# EAGLE design LEDCyrWheel (EAGLE 7.5.0)
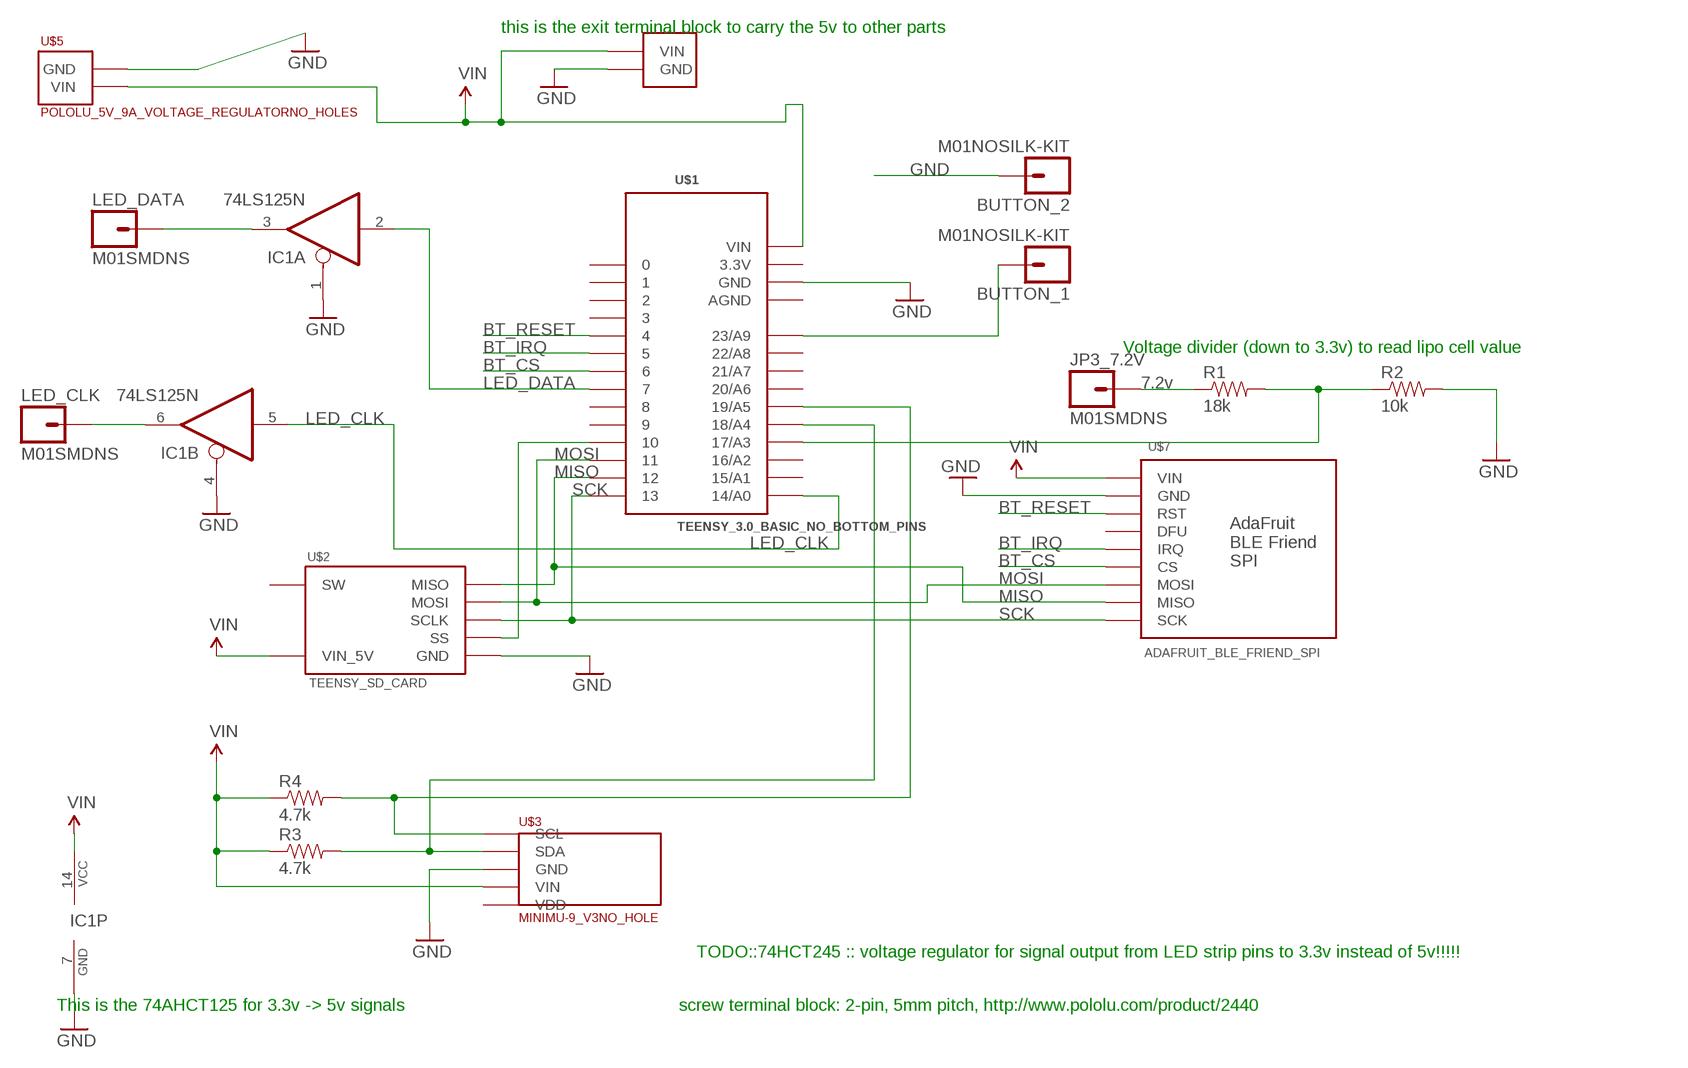
[diagram p0: schematic, sheet 1]

## Parts
BUTTON_1  M01NOSILK-KIT  [1X01NS-KIT]
BUTTON_2  M01NOSILK-KIT  [1X01NS-KIT]
IC1  74LS125N  [DIL14]
JP3_7.2V  M01SMDNS  [1X01NS]
LED_CLK  M01SMDNS  [1X01NS]
LED_DATA  M01SMDNS  [1X01NS]
R1  18k  RESISTORPTH-1/4W  [AXIAL-0.4]
R2  10k  RESISTORPTH-1/4W  [AXIAL-0.4]
R3  4.7k  RESISTORPTH-1/4W  [AXIAL-0.4]
R4  4.7k  RESISTORPTH-1/4W  [AXIAL-0.4]
U$1  TEENSY_3.0_BASIC_NO_BOTTOM_PINS  [TEENSY_3.0_BASIC_NO_BOTTOM_PINS]
U$2  TEENSY_SD_CARD  [TEENSY_SD_CARD]
U$3  MINIMU-9_V3NO_HOLE  [MINIMU-9_V3_NO_HOLE]
U$5  POLOLU_5V_9A_VOLTAGE_REGULATORNO_HOLES  [POLOLU_5V_9A_VOLTAGE_REGULATOR_NO_HOLES]
U$6  VIN_GND_HOLE  [VIN_HOLE]
U$7  ADAFRUIT_BLE_FRIEND_SPI  [ADAFRUIT_BLE_FRIEND_SPI]

## Nets
BT_CS: U$1.6 U$7.CS
BT_IRQ: U$1.5 U$7.IRQ
BT_RESET: U$1.4 U$7.RST
GND: BUTTON_2.1 IC1.1(A:OE) IC1.4(B:OE) IC1.7(P:GND) R2.P$2 U$1.GND U$2.GND U$3.GND U$5.GND U$5.GND2(GND) U$5.GND3(GND) U$6.GND U$7.GND
LED_CLK: IC1.5(B:I) U$1.14/A0
LED_DATA: IC1.2(A:I) U$1.7
MISO: U$1.12 U$2.MISO U$7.MISO
MOSI: U$1.11 U$2.MOSI U$7.MOSI
N$1: U$1.10 U$2.SS
N$2: IC1.6(B:O) LED_CLK.1
N$8: BUTTON_1.1 U$1.23/A9
N_PIN17: R1.P$2 R2.P$1 U$1.17/A3
N_PIN_2_LED_STRIP: IC1.3(A:O) LED_DATA.1
SCK: U$1.13 U$2.SCLK U$7.SCK
SCL: R4.P$2 U$1.19/A5 U$3.SCL
SDA: R3.P$2 U$1.18/A4 U$3.SDA
VIN: IC1.14(P:VCC) R3.P$1 R4.P$1 U$1.VIN U$2.VIN(VIN_5V) U$3.VIN U$5.VIN U$5.VIN2(VIN) U$5.VIN3(VIN) U$6.VIN U$7.VIN
VIN_7_2V: JP3_7.2V.1 R1.P$1
Unconnected: IC1.8(C:O) IC1.9(C:I) IC1.10(C:OE) IC1.11(D:O) IC1.12(D:I) IC1.13(D:OE) U$1.0 U$1.1 U$1.2 U$1.3 U$1.8 U$1.9 U$1.15/A1 U$1.16/A2 U$1.20/A6 U$1.21/A7 U$1.22/A8 U$2.SW U$3.VDD U$7.DFU

## Notes on the sheet
- this is the exit terminal block to carry the 5v to other parts
- Voltage divider (down to 3.3v) to read lipo cell value
- TODO::74HCT245 :: voltage regulator for signal output from LED strip pins to 3.3v instead of 5v!!!!!
- This is the 74AHCT125 for 3.3v -> 5v signals | screw terminal block: 2-pin, 5mm pitch, http://www.pololu.com/product/2440

## Power pins joined to a net without a drawn wire
3.3V: U$1.3.3V
AGND: U$1.AGND

## Library data of the parts
BUTTON_1 BUTTON_2 = SparkFun-Connectors:M01: Header 1 Standard 1-pin 0.1" header. Use with straight break away headers (SKU : PRT-00116), right angle break away headers (PRT-00553), swiss pins (PRT-00743), machine pins (PRT-00117), and female headers (PRT-00115).
IC1 = adafruit:74*125: Quad bus BUFFER, 3-state
JP3_7.2V = SparkFun:M01: Header 1 Standard 1-pin 0.1" header. Use with straight break away headers (SKU : PRT-00116), right angle break away headers (PRT-00553), swiss pins (PRT-00743), machine pins (PRT-00117), and female headers (PRT-00115).; VOLTAGE: 7.2v
LED_CLK LED_DATA = SparkFun:M01: Header 1 Standard 1-pin 0.1" header. Use with straight break away headers (SKU : PRT-00116), right angle break away headers (PRT-00553), swiss pins (PRT-00743), machine pins (PRT-00117), and female headers (PRT-00115).
R1-R4 = SparkFun:RESISTOR: Resistor Basic schematic elements and footprints for 0603, 1206, and PTH resistors.
U$1 = Teensy3.0:TEENSY_3.0_BASIC_NO_BOTTOM_PINS: Basic Teensy 3.0 with none of the 'inner' pins enabled. See '+4', 'AllAnalogPins", and 'AllPins' packages for additional pin holes, as needed.
U$2 = LEDCyrWheel:TEENSY_SD_CARD: TEENSY SD Card Aadapter
U$3 = LEDCyrWheel:MINIMU-9_V3: POLOLU's MinIMU-9 v3
U$5 = LEDCyrWheel:POLOLU_5V_9A_VOLTAGE_REGULATOR
U$6 = LEDCyrWheel:VIN_GND_HOLE
U$7 = LEDCyrWheel:ADAFRUIT_BLE_FRIEND_SPI

## Board
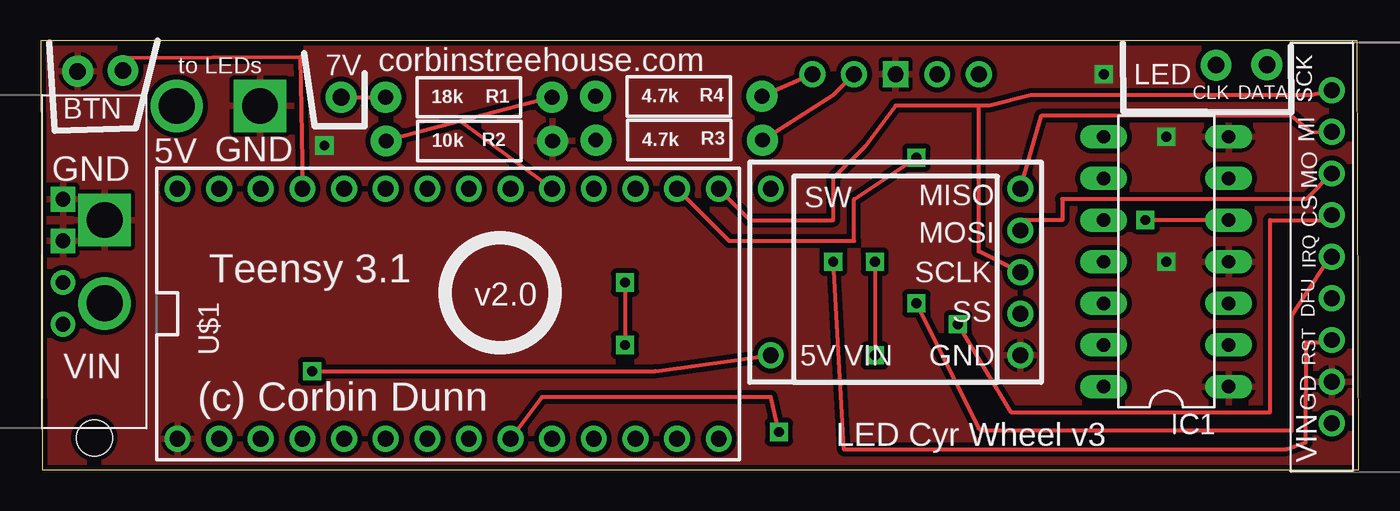
[diagram p1: board, top side]
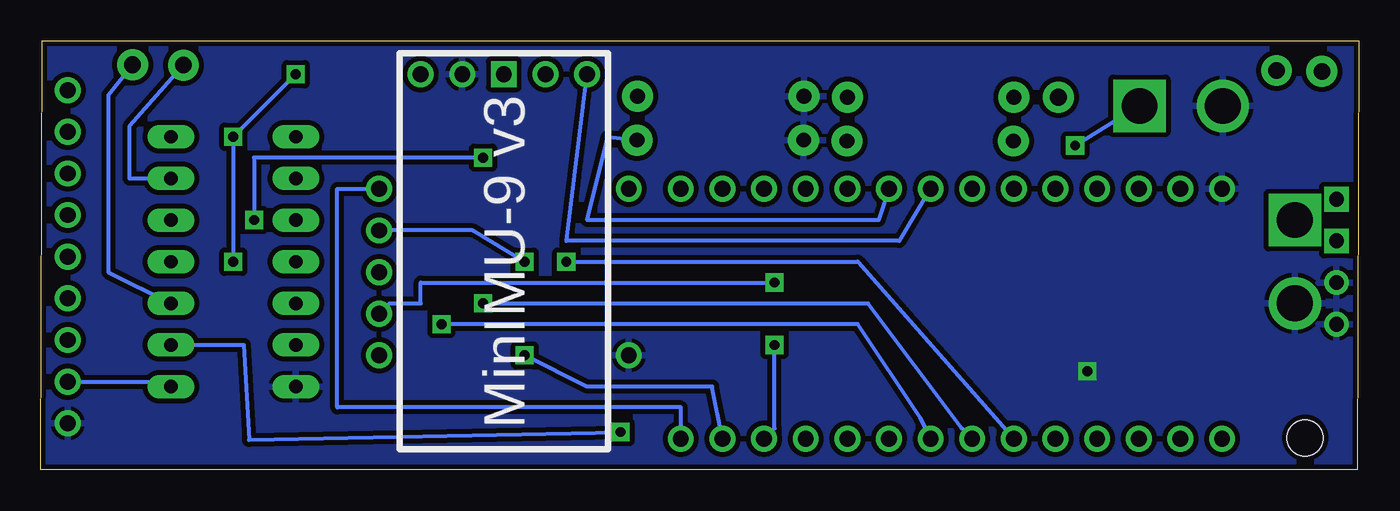
[diagram p2: board, bottom side, seen from below]

Size 80.39 x 26.16 mm. Coordinates in mm from the lower left corner, seen from the top.
Outline: 0.08,0 80.39,0 80.32,26.16 0,26.16 0.08,0
Copper layers (1*16): Top 0.035mm / dielectric 1.5mm / Bottom 0.035mm
Design rules "SparkFun": minimum track width 8mil, minimum drill 20mil, track to track 8mil, track to pad 8mil, pad to pad 8mil, via to via 8mil, smd to smd 8mil, copper to edge 8mil, drill to drill 8mil, minimum pad ring 12mil, minimum via ring 10mil, stop-mask expansion 4mil, vias tented up to drill 20mil, thermal gap 10mil
Holes 2.18 mm at 3.25,1.96

### Footprints (pad centres in the part's own frame; a part is rotated, then mirrored left to right if it is on the bottom)
1X01NS-KIT = drill 1.016 pad 1.88: 1 0,0
DIL14 = drill 0.813 long: 1 -7.62,-3.81; 2 -5.08,-3.81; 3 -2.54,-3.81; 4 0,-3.81; 5 2.54,-3.81; 6 5.08,-3.81; 7 7.62,-3.81; 8 7.62,3.81; 9 5.08,3.81; 10 2.54,3.81; 11 0,3.81; 12 -2.54,3.81; 13 -5.08,3.81; 14 -7.62,3.81
1X01NS = drill 1.016 pad 1.88: 1 0,0
AXIAL-0.4 = drill 0.9 pad 1.88: P$1 -5.08,0; P$2 5.08,0
TEENSY_3.0_BASIC_NO_BOTTOM_PINS = drill 0.965: 0 -7.62,13.97; 1 -7.62,11.43; 2 -7.62,8.89; 3 -7.62,6.35; 3.3V 7.62,11.43; 4 -7.62,3.81; 5 -7.62,1.27; 6 -7.62,-1.27; 7 -7.62,-3.81; 8 -7.62,-6.35; 9 -7.62,-8.89; 10 -7.62,-11.43; 11 -7.62,-13.97; 12 -7.62,-16.51; 13 7.62,-16.51; 14/A0 7.62,-13.97; 15/A1 7.62,-11.43; 16/A2 7.62,-8.89; 17/A3 7.62,-6.35; 18/A4 7.62,-3.81; 19/A5 7.62,-1.27; 20/A6 7.62,1.27; 21/A7 7.62,3.81; 22/A8 7.62,6.35; 23/A9 7.62,8.89; AGND 7.62,13.97; GND -7.62,16.51; VIN 7.62,16.51
TEENSY_SD_CARD = drill 0.965: GND 7.62,-5.08; MISO 7.62,5.08; MOSI 7.62,2.54; SCLK 7.62,0; SS 7.62,-2.54; SW -7.62,5.08; VIN -7.62,-5.08
MINIMU-9_V3_NO_HOLE = drill 0.965 square: GND -11.43,0 | drill 0.965: SCL -11.43,5.08; SDA -11.43,2.54; VDD -11.43,-5.08; VIN -11.43,-2.54
POLOLU_5V_9A_VOLTAGE_REGULATOR_NO_HOLES = drill 2.184 square: GND 19.05,2.54 | drill 0.9 square: GND2 16.51,3.81; GND3 16.51,1.27 | drill 2.184: VIN 19.05,-2.54 | drill 0.9: VIN2 16.51,-1.27; VIN3 16.51,-3.81
VIN_HOLE = drill 2.184 square: GND 0,2.54 | drill 2.184: VIN 0,-2.54
ADAFRUIT_BLE_FRIEND_SPI = drill 0.965: CS -13.97,2.921; DFU -13.97,-2.159; GND -13.97,-7.239; IRQ -13.97,0.381; MISO -13.97,8.001; MOSI -13.97,5.461; RST -13.97,-4.699; SCK -13.97,10.541; VIN -13.97,-9.779

### Placement (x,y rotation side)
BUTTON_1  5,24.36 0 top
BUTTON_2  2.24,24.31 0 top
IC1  68.66,12.7 90 top
JP3_7.2V  18.31,22.73 0 top
LED_CLK  71.7,24.69 0 top
LED_DATA  74.8,24.71 0 top
R1  26.11,22.73 0 top
R2  26.14,20.07 0 top
R3  38.94,20.12 0 top
R4  38.91,22.78 0 top
U$1  24.84,9.52 90 top
U$2  52.15,12.06 0 top
U$3  52.15,12.7 270 bottom
U$5  -15.16,12.7 0 top
U$6  10.82,22.2 270 top
U$7  92.74,12.62 0 top

### Tracks (layer width: path | path; a pad name or v marks a point on that pad's centre or on a via)
BT_CS  (via drill 0.6)
  Top 0.254: v55.96,8.89 59.18,3.53 75.01,3.53 75.01,15.24 78.77,15.24
  Top 0.406: 78.77,15.24 U$7.CS
  Bottom 0.254: U$1.6 26.75,3.17 30.56,8.89 v55.96,8.89
BT_IRQ  (via drill 0.6)
  Top 0.254: U$7.IRQ 78.46,12.7 76.3,9.37 76.3,2.39 57.38,2.39 57.23,2.54 v53.42,10.16
  Bottom 0.254: U$1.5 24.21,2.54 29.92,10.16 v53.42,10.16
BT_RESET  (via drill 0.6)
  Top 0.254: v48.34,12.7 48.97,1.27 76,1.27 77.17,1.68 77.22,7.77 78.61,7.77 U$7.RST
  Bottom 0.254: v48.34,12.7 30.56,12.7 U$1.4
GND  (via drill 0.6)
  Bottom 0.254: U$6.GND v17.3,19.79 | v68.66,12.7 v68.66,20.32 v64.85,24.13 | U$7.GND 72.77,5.38 IC1.1
  pour Top (isolate 0.305): 0.08,26.11 0.08,0 80.09,0 80.09,8.89 80.16,25.88 78.49,26.04 67.34,26.11
LED_CLK  (via drill 0.6)
  Top 0.254: U$1.14/A0 41.99,13.97 49.61,13.97 49.61,16.51 v53.42,19.05 | IC1.5 v67.39,15.24
  Bottom 0.254: v53.42,19.05 67.39,19.05 v67.39,15.24
LED_DATA  (via drill 0.6)
  Top 0.254: v45.03,2.31 44.53,4.45 30.56,4.45 U$1.7
  Bottom 0.254: IC1.2 68.02,7.62 67.69,1.83 v45.03,2.31
MISO
  Top 0.254: U$7.MISO 77.55,20.57 76.28,21.59 61.04,21.59 U$2.MISO
  Bottom 0.254: U$1.12 41.35,3.81 62.31,3.81 62.31,17.15 U$2.MISO
MOSI  (via drill 0.6)
  Top 0.254: v50.88,12.7 v50.88,6.98 | U$7.MOSI 77.19,16.51 62.31,16.51 62.31,15.24 59.77,15.24 U$2.MOSI
  Bottom 0.254: U$1.11 39.45,5.08 47.07,5.08 v50.88,6.98 | v50.88,12.7 54.05,14.6 U$2.MOSI
N$1  (via drill 0.6)
  Top 0.254: v35.64,11.43 v35.64,7.62
  Bottom 0.254: U$2.SS 59.13,10.16 57.23,10.16 57.23,11.43 v35.64,11.43 | U$1.10 35.64,2.54 v35.64,7.62
N$2
  Bottom 0.254: LED_CLK.1 75.01,20.95 75.01,17.78 IC1.6
N$8
  Top 0.254: BUTTON_1.1 4.98,24.36 4.98,25.15 15.82,25.2 U$1.23/A9
N_PIN17
  Top 0.254: R1.P$2 25.57,21.25 | 25.57,21.25 R2.P$1 | U$1.17/A3 25.57,21.25
N_PIN_2_LED_STRIP
  Bottom 0.254: LED_DATA.1 76.28,22.86 76.28,12.06 IC1.3
SCK
  Top 0.254: U$1.13 43.26,15.24 48.34,15.24 48.34,17.78 50.24,19.68 52.15,22.23 57.23,22.23 | U$2.SCLK 57.23,13.34 57.23,22.23 | U$7.SCK 77.55,22.86 60.4,22.86 57.86,22.23 57.23,22.23
SCL
  Top 0.254: U$3.SCL R4.P$2
  Bottom 0.254: U$1.19/A5 28.02,13.97 48.34,13.97 U$3.SCL
SDA
  Top 0.254: U$3.SDA 48.34,22.86 R3.P$2
  Bottom 0.254: U$1.18/A4 29.29,15.24 47.07,15.24 45.8,20.32 R3.P$2
VIN  (via drill 0.6)
  Top 0.254: v16.54,6.02 37.49,6.02 U$2.VIN
  pour Bottom (isolate 0.305): 0.08,26.09 0.08,0 80.21,0 80.21,26.06
VIN_7_2V
  Top 0.254: JP3_7.2V.1 R1.P$1

### Text on the board
tPlace: LED | to LEDs | 7V | corbinstreehouse.com | BTN | CLK | DATA | 5V | GND | Teensy 3.1 | v2.0 | (c) Corbin Dunn | LED Cyr Wheel v3